# Altium project Metlino.PrjPcb (part 1 of 13)
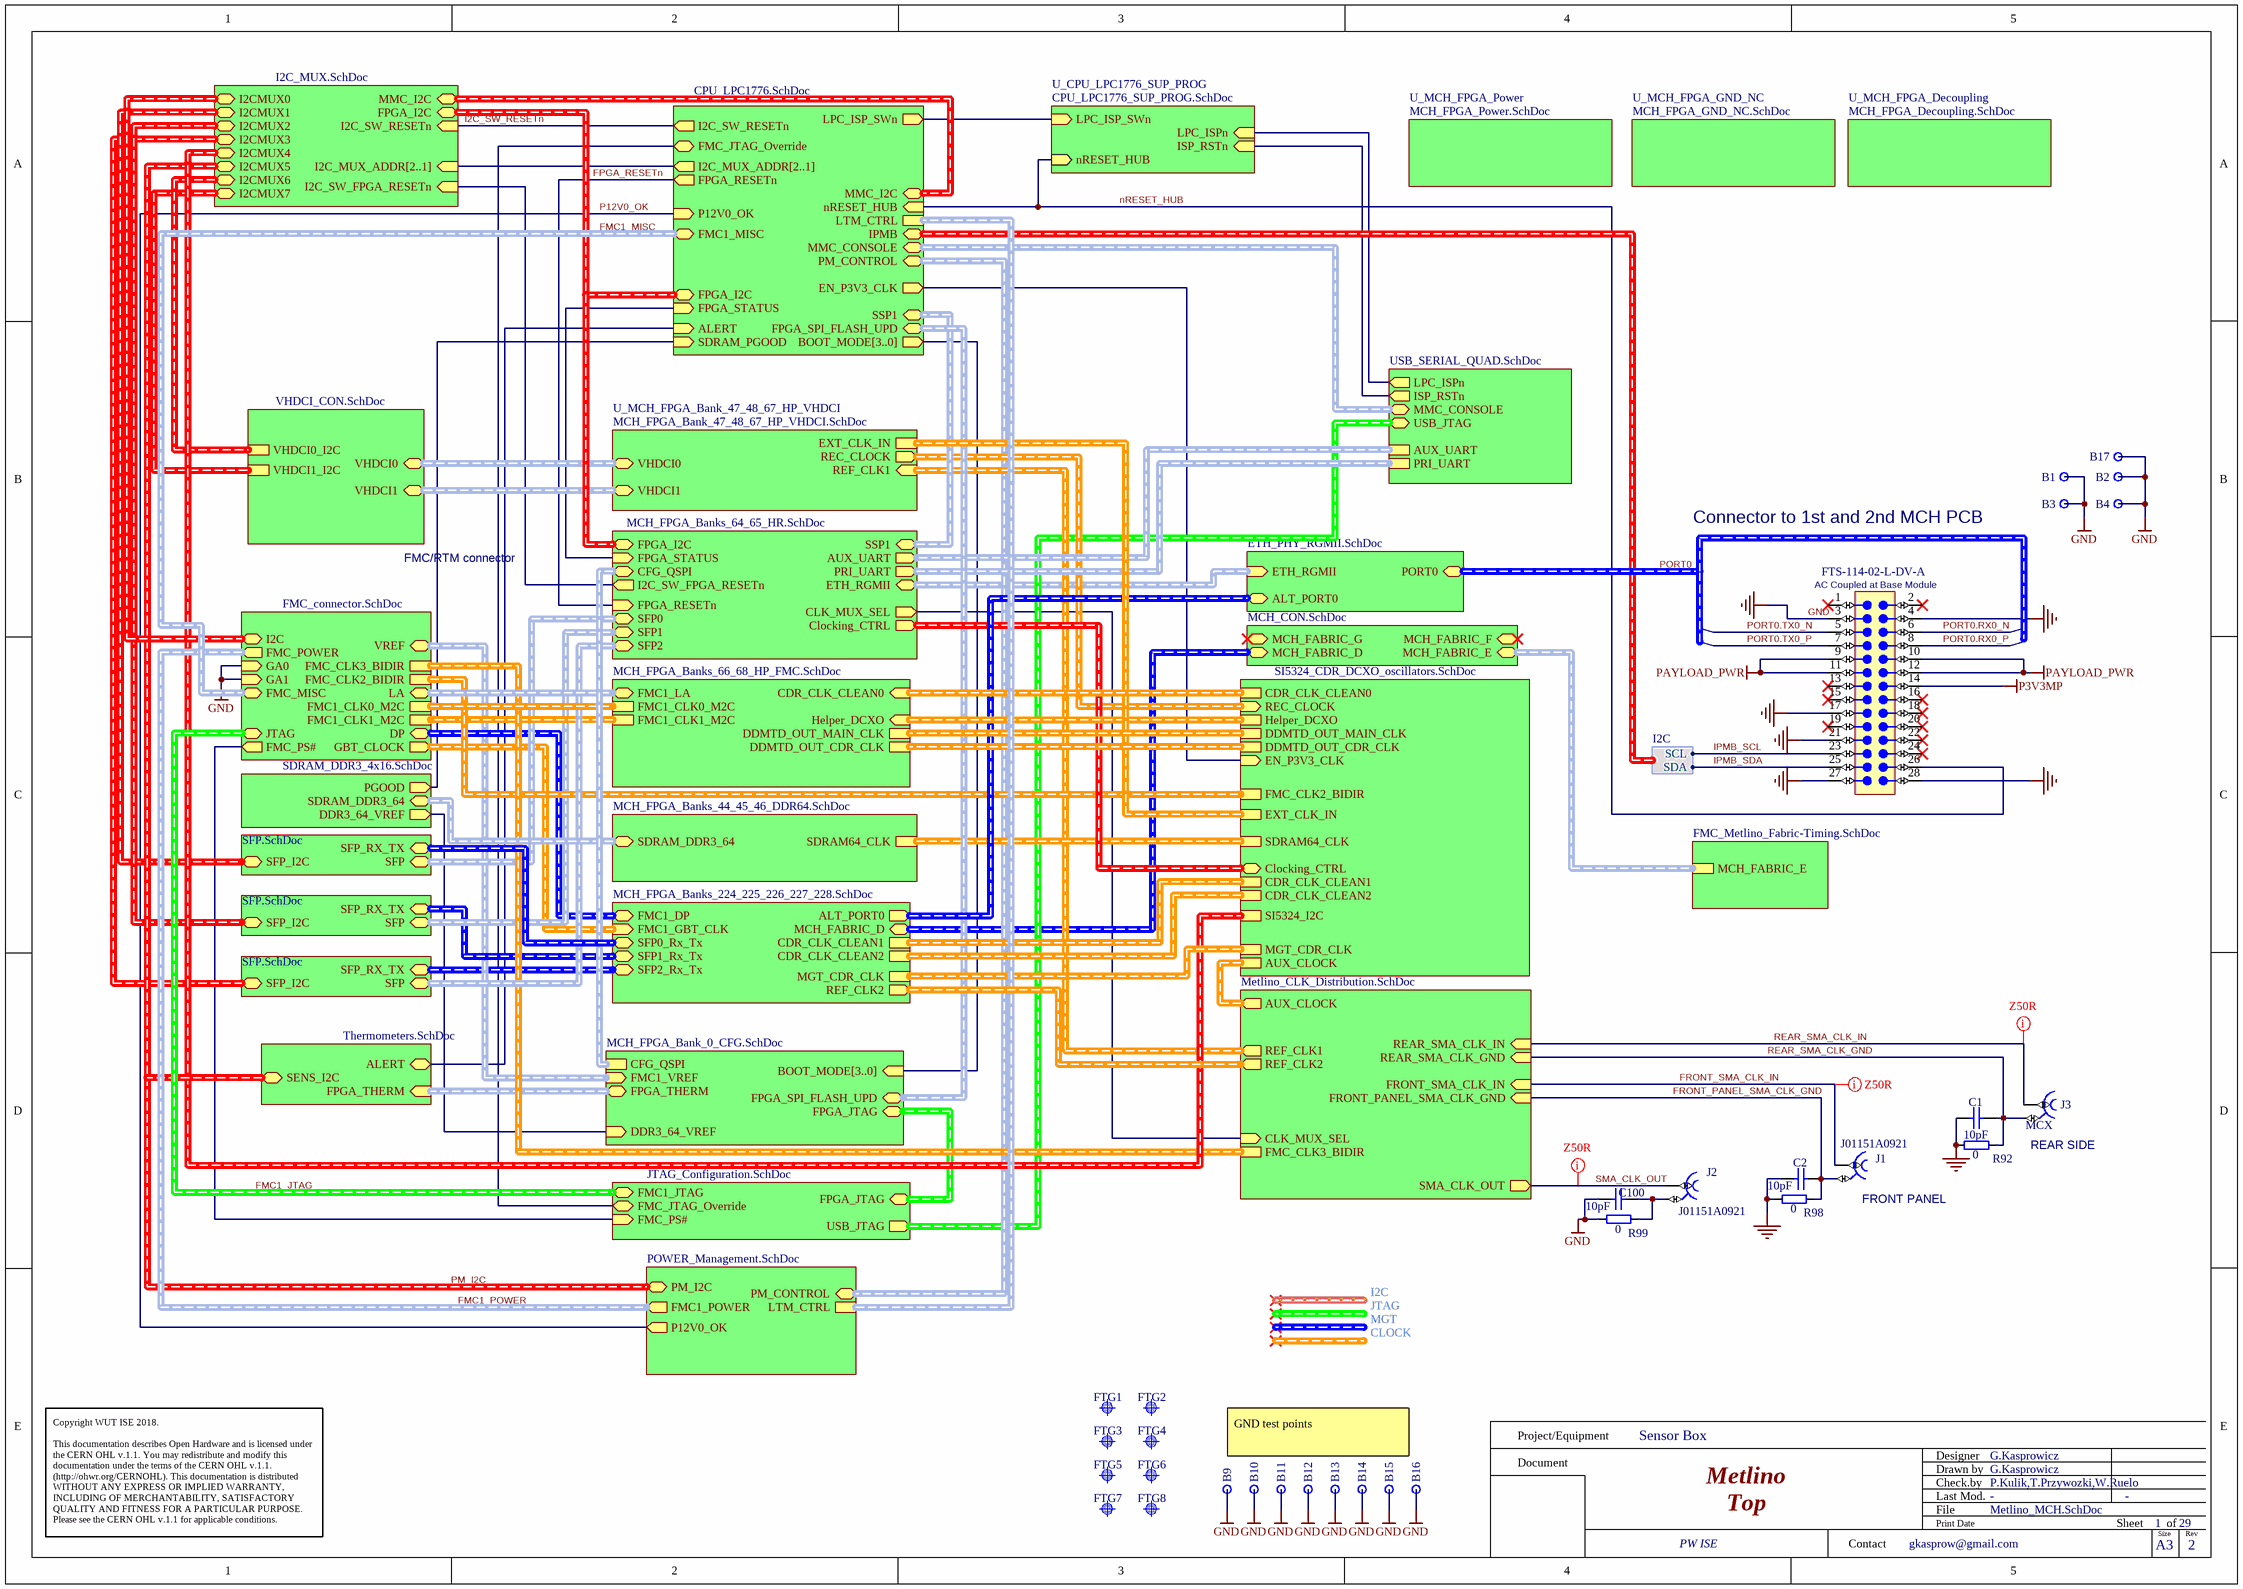
[diagram p0: Metlino_MCH.SchDoc]
30 sheets, 1308 parts. Net scope: hierarchical (ports join the sheet entries above them; power ports are global).
Board file: Metlino.PcbDoc
Sheets:
  Metlino_MCH.SchDoc
    USB_SERIAL_QUAD = USB_SERIAL_QUAD.SchDoc
    SFP1 = SFP.SchDoc
    SFP0 = SFP.SchDoc
    SI5324_CLK_RECOVERY = SI5324_CDR_DCXO_oscillators.SchDoc
      U_DDMTD = DDMTD.SchDoc
    FMC_connector = FMC_connector.SchDoc
    SDRAM_DDR3_4x16 = SDRAM_DDR3_4x16.SchDoc
    JTAG_Configuration = JTAG_Configuration.SchDoc
    POWER_Management = POWER_Management.SchDoc
      PWR_0V9_20A = PWR_0V9_20A.SchDoc
      PWR_DC_DC_EXAR = PWR_DC_DC_EXAR.SchDoc
        U_QUAD_BUCK = Metlino_QUAD_BUCK.SchDoc
    MCH_CON = MCH_CON.SchDoc
    Metlino_CLK_Distribution = Metlino_CLK_Distribution.SchDoc
    Thermometers = Thermometers.SchDoc
    VHDCI_CON = VHDCI_CON.SchDoc
    ETH_PHY_RGMII = ETH_PHY_RGMII.SchDoc
    I2C_MUX = I2C_MUX.SchDoc
    SFP2 = SFP.SchDoc
    U_CPU_LPC1776 = CPU_LPC1776.SchDoc
    U_CPU_LPC1776_SUP_PROG = CPU_LPC1776_SUP_PROG.SchDoc
    U_MCH_FPGA_Banks_44_45_46_DDR64 = MCH_FPGA_Banks_44_45_46_DDR64.SchDoc
    U_MCH_FPGA_Banks_64_65_HR = MCH_FPGA_Banks_64_65_HR.SchDoc
    U_MCH_FPGA_Banks_224_225_226_227_228 = MCH_FPGA_Banks_224_225_226_227_228.SchDoc
    U_MCH_FPGA_Bank_47_48_67_HP_VHDCI = MCH_FPGA_Bank_47_48_67_HP_VHDCI.SchDoc
    U_MCH_FPGA_Bank_0_CFG = MCH_FPGA_Bank_0_CFG.SchDoc
    U_MCH_FPGA_Banks_66_68_HP_FMC = MCH_FPGA_Banks_66_68_HP_FMC.SchDoc
    U_MCH_FPGA_Power = MCH_FPGA_Power.SchDoc
    U_MCH_FPGA_GND_NC = MCH_FPGA_GND_NC.SchDoc
    U_MCH_FPGA_Decoupling = MCH_FPGA_Decoupling.SchDoc
    FMC_Metlino_Fabric-Timing = FMC_Metlino_Fabric-Timing.SchDoc

## Sheet Metlino_MCH.SchDoc: Metlino
size 420 x 297 mm; CheckedBy: P.Kulik,T.Przywozki,W.Ruclo; Author: G.Kasprowicz; CompanyName: WUT ISE; DrawnBy: G.Kasprowicz; Organization: WUT ISE; Address1: PW ISE; Address2: Nowowiejska 15/19 00-665 Warsaw; Address3: gkasprow@gmail.com; DocumentNumber: 1; Revision: 2; SheetNumber: 1; SheetTotal: 29; ModifiedBy: -; CheckedDate: -; Title2: Top; DivGrp: WUT ISE; Designer: G.Kasprowicz; ModifiedDate: -; ProjectName: Sensor Box

### Parts
B1  Plated Hole  [MTG320_550]  (value not drawn)  (no BOM)
B2  Plated Hole  [MTG320_550]  (value not drawn)  (no BOM)
B3  Plated Hole  [MTG320_550]  (value not drawn)  (no BOM)
B4  Plated Hole  [MTG320_550]  (value not drawn)  (no BOM)
B9  Plated Hole  [c130h80]  (value not drawn)  (no BOM)
B10  Plated Hole  [c130h80]  (value not drawn)  (no BOM)
B11  Plated Hole  [c130h80]  (value not drawn)  (no BOM)
B12  Plated Hole  [c130h80]  (value not drawn)  (no BOM)
B13  Plated Hole  [c130h80]  (value not drawn)  (no BOM)
B14  Plated Hole  [c130h80]  (value not drawn)  (no BOM)
B15  Plated Hole  [c130h80]  (value not drawn)  (no BOM)
B16  Plated Hole  [c130h80]  (value not drawn)  (no BOM)
B17  Plated Hole  [MTG320_550]  (value not drawn)  (no BOM)
C1  10pF  [CAPC1608X87N]
C2  10pF  [CAPC1608X87N]
C100  10pF  [CAPC1608X87N]
FTG1  Use only in PCB  [FIDUCIAL_TOP_C100-200]  (value not drawn)
FTG2  Use only in PCB  [FIDUCIAL_TOP_S100-200]  (value not drawn)
FTG3  Use only in PCB  [FIDUCIAL_TOP_C100-200]  (value not drawn)
FTG4  Use only in PCB  [FIDUCIAL_TOP_S100-200]  (value not drawn)
FTG5  Use only in PCB  [FIDUCIAL_TOP_C100-200]  (value not drawn)
FTG6  Use only in PCB  [FIDUCIAL_TOP_S100-200]  (value not drawn)
FTG7  Use only in PCB  [FIDUCIAL_TOP_C100-200]  (value not drawn)
FTG8  Use only in PCB  [FIDUCIAL_TOP_S100-200]  (value not drawn)
J1  Manufacturer Part Number: J01151A0921  [TELEGARTNER_J01151A0921]  (hidden comment: SMA)
J2  Manufacturer Part Number: J01151A0921  [TELEGARTNER_J01151A0921]  (hidden comment: SMA)
J3  MCX  [AMPHENOL_ARF2521-ND]
J4  Manufacturer Part Number: FTS-114-02-L-DV-A  [SAMTEC_FTS-114-02-L-DV-A]  (hidden comment: Header 28)
R92  0  [RESC1608X55N]
R98  0  [RESC1608X55N]
R99  0  [RESC1608X55N]

### Sub-sheets
ETH_PHY_RGMII = ETH_PHY_RGMII.SchDoc: ETH_RGMII (in, harness ETH_RGMII), PORT0 (bidir, harness MGTx1), ALT_PORT0 (bidir, harness MGTx1)  | CmpIndex: 10; Name: ETH_PHY; SymIndex: 1511
FMC_connector = FMC_connector.SchDoc: GBT_CLOCK (out, harness FMC_GBT_CLK), VREF (bidir, harness FMC_VREF), JTAG (bidir, harness JTAG), FMC_MISC (bidir, harness FMC_MICS), I2C (bidir, harness I2C), LA (bidir, harness FMC_LA), DP (bidir, harness FMC_DP), FMC_POWER (out, harness FMC_POWER), FMC1_CLK1_M2C (harness DIFF_CLK), FMC1_CLK0_M2C (harness DIFF_CLK), GA0 (in), GA1 (in), FMC_CLK3_BIDIR (harness DIFF_CLK), FMC_CLK2_BIDIR (harness DIFF_CLK), FMC_PS# (out)  | $$NotCommonProperty_SHEETNAME: HPC1; CmpIndex: 113; Name: FMC_HPC; SHEETNAME: SHEETNAME; SymIndex: 792
FMC_Metlino_Fabric-Timing = FMC_Metlino_Fabric-Timing.SchDoc: MCH_FABRIC_E
I2C_MUX = I2C_MUX.SchDoc: FPGA_I2C (bidir, harness I2C), MMC_I2C (bidir, harness I2C), I2CMUX7 (bidir, harness I2C), I2CMUX6 (bidir, harness I2C), I2CMUX5 (bidir, harness I2C), I2CMUX3 (bidir, harness I2C), I2CMUX2 (bidir, harness I2C), I2CMUX1 (bidir, harness I2C), I2CMUX0 (bidir, harness I2C), I2C_SW_RESETn (in), I2CMUX4 (bidir, harness I2C), I2C_MUX_ADDR[2..1] (in), I2C_SW_FPGA_RESETn (in)  | CmpIndex: 4; Name: I2C_MUX10055; SymIndex: 1875
JTAG_Configuration = JTAG_Configuration.SchDoc: FMC1_JTAG (bidir, harness JTAG), FPGA_JTAG (bidir, harness FPGA_JTAG), USB_JTAG (out, harness USB_JTAG), FMC_PS# (in), FMC_JTAG_Override (bidir)  | $$NotCommonProperty_SHEETNAME: JTAG_CONF; CmpIndex: 107; Name: JTAG_CONF; SHEETNAME: SHEETNAME; SymIndex: 798
MCH_CON = MCH_CON.SchDoc: MCH_FABRIC_E (bidir, harness MCH_FABRIC_E), MCH_FABRIC_D (bidir, harness MCH_FABRIC_D), MCH_FABRIC_F (bidir, harness MCH_FABRIC_F), MCH_FABRIC_G (bidir, harness MCH_FABRIC_G)  | CmpIndex: 102; Name: MCH_CON; SymIndex: 1698
Metlino_CLK_Distribution = Metlino_CLK_Distribution.SchDoc: FRONT_SMA_CLK_IN (in), SMA_CLK_OUT (out), CLK_MUX_SEL (in), REAR_SMA_CLK_IN (in), REAR_SMA_CLK_GND (in), FRONT_PANEL_SMA_CLK_GND (in), REF_CLK1 (out, harness DIFF_CLK), AUX_CLOCK (out, harness DIFF_CLK), FMC_CLK3_BIDIR (harness DIFF_CLK), REF_CLK2 (out, harness DIFF_CLK)  | CmpIndex: 87; Name: Metlino_CLK_Distribution; SymIndex: 1758
POWER_Management = POWER_Management.SchDoc: FMC1_POWER (out, harness FMC1_POWER), PM_CONTROL (bidir, harness PM_CONTROL), PM_I2C (bidir, harness I2C), P12V0_OK (out), LTM_CTRL (harness LTM_CTRL)  | $$NotCommonProperty_SHEETNAME: PWR_MGT; CmpIndex: 105; Name: PWR_MGT; SHEETNAME: SHEETNAME; SymIndex: 796
SDRAM_DDR3_4x16 = SDRAM_DDR3_4x16.SchDoc: PGOOD (out), SDRAM_DDR3_64 (bidir, harness SDRAM_DDR3_64), DDR3_64_VREF (out)  | CmpIndex: 111; SymIndex: 276
SFP0 = SFP.SchDoc: SFP (bidir, harness SFP_CTL), SFP_RX_TX (bidir, harness SFP_MGT), SFP_I2C (bidir, harness I2C)  | CmpIndex: 116; SymIndex: 1422
SFP1 = SFP.SchDoc: SFP (bidir, harness SFP_CTL), SFP_RX_TX (bidir, harness SFP_MGT), SFP_I2C (bidir, harness I2C)  | CmpIndex: 119; SymIndex: 1422
SFP2 = SFP.SchDoc: SFP (bidir, harness SFP_CTL), SFP_RX_TX (bidir, harness SFP_MGT), SFP_I2C (bidir, harness I2C)  | CmpIndex: 3; SymIndex: 1422
SI5324_CLK_RECOVERY = SI5324_CDR_DCXO_oscillators.SchDoc: Clocking_CTRL (bidir, harness WR_I2C_CTRL), Helper_DCXO (harness DIFF_CLK), EXT_CLK_IN (harness DIFF_CLK), SDRAM64_CLK (harness DIFF_CLK), SI5324_I2C (harness I2C), CDR_CLK_CLEAN1 (harness DIFF_CLK), REC_CLOCK (in, harness DIFF_CLK), AUX_CLOCK (harness DIFF_CLK), FMC_CLK2_BIDIR (harness DIFF_CLK), CDR_CLK_CLEAN0 (harness DIFF_CLK), DDMTD_OUT_CDR_CLK (harness DIFF_CLK), DDMTD_OUT_MAIN_CLK (harness DIFF_CLK), MGT_CDR_CLK (harness DIFF_CLK), CDR_CLK_CLEAN2 (harness DIFF_CLK), EN_P3V3_CLK (in)  | CmpIndex: 115; Name: Si5324 Clock recovery9459912232034; SymIndex: 1416
Thermometers = Thermometers.SchDoc: ALERT (bidir), FPGA_THERM (in, harness FPGA_THERM), SENS_I2C (bidir, harness I2C)  | $$NotCommonProperty_SHEETNAME: THERMO; CmpIndex: 47; Name: THERMAL_SENSORS; SymIndex: 789
U_CPU_LPC1776 = CPU_LPC1776.SchDoc: FMC1_MISC (bidir, harness FMC_MICS), I2C_MUX_ADDR[2..1] (out), BOOT_MODE[3..0] (out), FMC_JTAG_Override (bidir), FPGA_SPI_FLASH_UPD (bidir, harness FLASH_UPD), FPGA_RESETn (out), nRESET_HUB (in), MMC_CONSOLE (bidir, harness UART), SDRAM_PGOOD (in), FPGA_I2C (bidir, harness I2C), MMC_I2C (bidir, harness I2C), IPMB (bidir, harness I2C), PM_CONTROL (bidir, harness PM_CONTROL), I2C_SW_RESETn (out), P12V0_OK (in), ALERT (in), LPC_ISP_SWn (out), SSP1 (bidir, harness SPI), FPGA_STATUS (in), LTM_CTRL (harness LTM_CTRL), EN_P3V3_CLK (out)
U_CPU_LPC1776_SUP_PROG = CPU_LPC1776_SUP_PROG.SchDoc: LPC_ISP_SWn (in), ISP_RSTn (in), LPC_ISPn (in), nRESET_HUB (in)
U_MCH_FPGA_Bank_0_CFG = MCH_FPGA_Bank_0_CFG.SchDoc: BOOT_MODE[3..0] (in), FMC1_VREF (in, harness FMC_VREF), FPGA_THERM (bidir, harness FPGA_THERM), FPGA_JTAG (bidir, harness FPGA_JTAG), FPGA_SPI_FLASH_UPD (bidir, harness FPGA_SPI_FLASH_UPD), DDR3_64_VREF (in), CFG_QSPI (harness CFG_QSPI)
U_MCH_FPGA_Bank_47_48_67_HP_VHDCI = MCH_FPGA_Bank_47_48_67_HP_VHDCI.SchDoc: REF_CLK1 (in, harness DIFF_CLK), VHDCI1 (bidir, harness VHDCI1), VHDCI0 (bidir, harness VHDCI0), REC_CLOCK (out, harness DIFF_CLK), EXT_CLK_IN (harness DIFF_CLK)
U_MCH_FPGA_Banks_44_45_46_DDR64 = MCH_FPGA_Banks_44_45_46_DDR64.SchDoc: SDRAM_DDR3_64 (bidir, harness SDRAM_DDR3_64), SDRAM64_CLK (harness DIFF_CLK)
U_MCH_FPGA_Banks_64_65_HR = MCH_FPGA_Banks_64_65_HR.SchDoc: Clocking_CTRL (out, harness WR_I2C_CTRL), SFP1 (bidir, harness SFP_CTL), CLK_MUX_SEL (out), AUX_UART (out, harness UART), PRI_UART (out, harness UART), SFP0 (bidir, harness SFP_CTL), FPGA_RESETn (in), FPGA_I2C (bidir, harness I2C), SFP2 (bidir, harness SFP_CTL), ETH_RGMII (bidir, harness ETH_RGMII), FPGA_STATUS (in), CFG_QSPI (bidir, harness CFG_QSPI), SSP1 (bidir, harness SPI), I2C_SW_FPGA_RESETn (out)
U_MCH_FPGA_Banks_66_68_HP_FMC = MCH_FPGA_Banks_66_68_HP_FMC.SchDoc: Helper_DCXO (in, harness DIFF_CLK), CDR_CLK_CLEAN0 (in, harness DIFF_CLK), FMC1_LA (bidir, harness FMC_LA), FMC1_CLK0_M2C (harness DIFF_CLK), FMC1_CLK1_M2C (harness DIFF_CLK), DDMTD_OUT_CDR_CLK (harness DIFF_CLK), DDMTD_OUT_MAIN_CLK (harness DIFF_CLK)
U_MCH_FPGA_Banks_224_225_226_227_228 = MCH_FPGA_Banks_224_225_226_227_228.SchDoc: ALT_PORT0 (out, harness MGTx1), SFP0_Rx_Tx (bidir, harness SFP_MGT), SFP1_Rx_Tx (bidir, harness SFP_MGT), MCH_FABRIC_D (bidir, harness MCH_FABRIC_D), FMC1_DP (bidir, harness FMC_DP), FMC1_GBT_CLK (in, harness FMC1_GBT_CLK), SFP2_Rx_Tx (bidir, harness SFP_MGT), CDR_CLK_CLEAN2 (harness DIFF_CLK), MGT_CDR_CLK (harness DIFF_CLK), CDR_CLK_CLEAN1 (harness DIFF_CLK), REF_CLK2 (out, harness DIFF_CLK)
U_MCH_FPGA_Decoupling = MCH_FPGA_Decoupling.SchDoc: no entries
U_MCH_FPGA_GND_NC = MCH_FPGA_GND_NC.SchDoc: no entries
U_MCH_FPGA_Power = MCH_FPGA_Power.SchDoc: no entries
USB_SERIAL_QUAD = USB_SERIAL_QUAD.SchDoc: MMC_CONSOLE (bidir, harness UART), USB_JTAG (bidir, harness USB_JTAG), LPC_ISPn (out), ISP_RSTn (out), AUX_UART (harness UART), PRI_UART (harness UART)  | CmpIndex: 121; Name: USB_UART_QUAD; SymIndex: 807
VHDCI_CON = VHDCI_CON.SchDoc: VHDCI1 (bidir, harness VHDCI1), VHDCI0 (bidir, harness VHDCI0), VHDCI1_I2C (harness I2C), VHDCI0_I2C (harness I2C)  | CmpIndex: 11; Name: VHDCI_CON; SymIndex: 1699

### Harnesses
I2C: SCL, SDA

### Nets
GND: B1.1 B2.1 B3.1 B4.1 B9.1 B10.1 B11.1 B12.1 B13.1 B14.1 B15.1 B16.1 B17.1 C1.2 C2.2 C100.2 J4.3 J4.4 J4.17 J4.21 J4.27 J4.28 R92.1 R98.1 R99.1 ; sheet FMC_connector/GA0, sheet FMC_connector/GA1
P3V3MP: J4.14
PAYLOAD_PWR: J4.9 J4.10 J4.11 J4.12
CLK_MUX_SEL: sheet Metlino_CLK_Distribution/CLK_MUX_SEL, sheet U_MCH_FPGA_Banks_64_65_HR/CLK_MUX_SEL
DDR3_64_VREF: sheet SDRAM_DDR3_4x16/DDR3_64_VREF, sheet U_MCH_FPGA_Bank_0_CFG/DDR3_64_VREF
FMC1_MISC.FMC_PS#: sheet FMC_connector/FMC_PS#, sheet JTAG_Configuration/FMC_PS#
FPGA_RESETn: sheet U_CPU_LPC1776/FPGA_RESETn, sheet U_MCH_FPGA_Banks_64_65_HR/FPGA_RESETn
FPGA_STATUS: sheet U_CPU_LPC1776/FPGA_STATUS, sheet U_MCH_FPGA_Banks_64_65_HR/FPGA_STATUS
FRONT_PANEL_SMA_CLK_GND: C2.1 J1.2 R98.2 ; sheet Metlino_CLK_Distribution/FRONT_PANEL_SMA_CLK_GND
FRONT_SMA_CLK_IN: J1.1 ; sheet Metlino_CLK_Distribution/FRONT_SMA_CLK_IN
I2C_SW_FPGA_RESETn: sheet I2C_MUX/I2C_SW_FPGA_RESETn, sheet U_MCH_FPGA_Banks_64_65_HR/I2C_SW_FPGA_RESETn
I2C_SW_RESETn: sheet I2C_MUX/I2C_SW_RESETn, sheet U_CPU_LPC1776/I2C_SW_RESETn
IPMB_SCL: J4.23 ; sheet U_CPU_LPC1776/IPMB.SCL
IPMB_SDA: J4.25 ; sheet U_CPU_LPC1776/IPMB.SDA
ISP_RSTn: sheet USB_SERIAL_QUAD/ISP_RSTn, sheet U_CPU_LPC1776_SUP_PROG/ISP_RSTn
LPC_ISP_SWn: sheet U_CPU_LPC1776/LPC_ISP_SWn, sheet U_CPU_LPC1776_SUP_PROG/LPC_ISP_SWn
LPC_ISPn: sheet USB_SERIAL_QUAD/LPC_ISPn, sheet U_CPU_LPC1776_SUP_PROG/LPC_ISPn
nRESET_HUB: J4.26 ; sheet U_CPU_LPC1776/nRESET_HUB, sheet U_CPU_LPC1776_SUP_PROG/nRESET_HUB  [project net MRnR]
P12V0_OK: sheet POWER_Management/P12V0_OK, sheet U_CPU_LPC1776/P12V0_OK
PGOOD: sheet SDRAM_DDR3_4x16/PGOOD, sheet U_CPU_LPC1776/SDRAM_PGOOD
PORT0.RX0_N: J4.6
PORT0.RX0_P: J4.8
PORT0.TX0_N: J4.5
PORT0.TX0_P: J4.7
REAR_SMA_CLK_GND: C1.1 J3.2 R92.2 ; sheet Metlino_CLK_Distribution/REAR_SMA_CLK_GND
REAR_SMA_CLK_IN: J3.1 ; sheet Metlino_CLK_Distribution/REAR_SMA_CLK_IN
SMA_CLK_OUT: J2.1 ; sheet Metlino_CLK_Distribution/SMA_CLK_OUT
NetC100_1: C100.1 J2.2 R99.2
NetIC13_4: sheet JTAG_Configuration/FMC_JTAG_Override, sheet U_CPU_LPC1776/FMC_JTAG_Override
NetIC17_1: sheet SI5324_CLK_RECOVERY/EN_P3V3_CLK, sheet U_CPU_LPC1776/EN_P3V3_CLK
NetIC34_3: sheet Thermometers/ALERT, sheet U_CPU_LPC1776/ALERT

Not connected (* = marked no-connect by the designer): J4 1* 2* 13* 15* 16* 18* 19* 20* 22* 24*

### Buses and harness runs
bus sheet I2C_MUX/I2C_MUX_ADDR[2..1] = sheet U_CPU_LPC1776/I2C_MUX_ADDR[2..1]
bus sheet U_CPU_LPC1776/BOOT_MODE[3..0] = sheet U_MCH_FPGA_Bank_0_CFG/BOOT_MODE[3..0]
harness FMC1_JTAG = sheet FMC_connector/JTAG = sheet JTAG_Configuration/FMC1_JTAG
harness FMC1_MISC = sheet FMC_connector/FMC_MISC = sheet U_CPU_LPC1776/FMC1_MISC
harness FMC1_POWER = sheet FMC_connector/FMC_POWER = sheet POWER_Management/FMC1_POWER
harness PM_I2C = sheet I2C_MUX/I2CMUX5 = sheet POWER_Management/PM_I2C = sheet Thermometers/SENS_I2C
harness PORT0 = sheet ETH_PHY_RGMII/PORT0
harness sheet ETH_PHY_RGMII/ALT_PORT0 = sheet U_MCH_FPGA_Banks_224_225_226_227_228/ALT_PORT0
harness sheet ETH_PHY_RGMII/ETH_RGMII = sheet U_MCH_FPGA_Banks_64_65_HR/ETH_RGMII
harness sheet FMC_connector/DP = sheet U_MCH_FPGA_Banks_224_225_226_227_228/FMC1_DP
harness sheet FMC_connector/FMC1_CLK0_M2C = sheet U_MCH_FPGA_Banks_66_68_HP_FMC/FMC1_CLK0_M2C
harness sheet FMC_connector/FMC1_CLK1_M2C = sheet U_MCH_FPGA_Banks_66_68_HP_FMC/FMC1_CLK1_M2C
harness sheet FMC_connector/FMC_CLK2_BIDIR = sheet SI5324_CLK_RECOVERY/FMC_CLK2_BIDIR
harness sheet FMC_connector/FMC_CLK3_BIDIR = sheet Metlino_CLK_Distribution/FMC_CLK3_BIDIR
harness sheet FMC_connector/GBT_CLOCK = sheet U_MCH_FPGA_Banks_224_225_226_227_228/FMC1_GBT_CLK
harness sheet FMC_connector/I2C = sheet I2C_MUX/I2CMUX0
harness sheet FMC_connector/LA = sheet U_MCH_FPGA_Banks_66_68_HP_FMC/FMC1_LA
harness sheet FMC_connector/VREF = sheet U_MCH_FPGA_Bank_0_CFG/FMC1_VREF
harness sheet FMC_Metlino_Fabric-Timing/MCH_FABRIC_E = sheet MCH_CON/MCH_FABRIC_E
harness sheet I2C_MUX/FPGA_I2C = sheet U_CPU_LPC1776/FPGA_I2C = sheet U_MCH_FPGA_Banks_64_65_HR/FPGA_I2C
harness sheet I2C_MUX/I2CMUX1 = sheet SFP0/SFP_I2C
harness sheet I2C_MUX/I2CMUX2 = sheet SFP1/SFP_I2C
harness sheet I2C_MUX/I2CMUX3 = sheet SFP2/SFP_I2C
harness sheet I2C_MUX/I2CMUX4 = sheet SI5324_CLK_RECOVERY/SI5324_I2C
harness sheet I2C_MUX/I2CMUX6 = sheet VHDCI_CON/VHDCI0_I2C
harness sheet I2C_MUX/I2CMUX7 = sheet VHDCI_CON/VHDCI1_I2C
harness sheet I2C_MUX/MMC_I2C = sheet U_CPU_LPC1776/MMC_I2C
harness sheet JTAG_Configuration/FPGA_JTAG = sheet U_MCH_FPGA_Bank_0_CFG/FPGA_JTAG
harness sheet JTAG_Configuration/USB_JTAG = sheet USB_SERIAL_QUAD/USB_JTAG
harness sheet MCH_CON/MCH_FABRIC_D = sheet U_MCH_FPGA_Banks_224_225_226_227_228/MCH_FABRIC_D
harness sheet Metlino_CLK_Distribution/AUX_CLOCK = sheet SI5324_CLK_RECOVERY/AUX_CLOCK
harness sheet Metlino_CLK_Distribution/REF_CLK1 = sheet U_MCH_FPGA_Bank_47_48_67_HP_VHDCI/REF_CLK1
harness sheet Metlino_CLK_Distribution/REF_CLK2 = sheet U_MCH_FPGA_Banks_224_225_226_227_228/REF_CLK2
harness sheet POWER_Management/LTM_CTRL = sheet U_CPU_LPC1776/LTM_CTRL
harness sheet POWER_Management/PM_CONTROL = sheet U_CPU_LPC1776/PM_CONTROL
harness sheet SDRAM_DDR3_4x16/SDRAM_DDR3_64 = sheet U_MCH_FPGA_Banks_44_45_46_DDR64/SDRAM_DDR3_64
harness sheet SFP0/SFP = sheet U_MCH_FPGA_Banks_64_65_HR/SFP0
harness sheet SFP0/SFP_RX_TX = sheet U_MCH_FPGA_Banks_224_225_226_227_228/SFP0_Rx_Tx
harness sheet SFP1/SFP = sheet U_MCH_FPGA_Banks_64_65_HR/SFP1
harness sheet SFP1/SFP_RX_TX = sheet U_MCH_FPGA_Banks_224_225_226_227_228/SFP1_Rx_Tx
harness sheet SFP2/SFP = sheet U_MCH_FPGA_Banks_64_65_HR/SFP2
harness sheet SFP2/SFP_RX_TX = sheet U_MCH_FPGA_Banks_224_225_226_227_228/SFP2_Rx_Tx
harness sheet SI5324_CLK_RECOVERY/CDR_CLK_CLEAN0 = sheet U_MCH_FPGA_Banks_66_68_HP_FMC/CDR_CLK_CLEAN0
harness sheet SI5324_CLK_RECOVERY/CDR_CLK_CLEAN1 = sheet U_MCH_FPGA_Banks_224_225_226_227_228/CDR_CLK_CLEAN1
harness sheet SI5324_CLK_RECOVERY/CDR_CLK_CLEAN2 = sheet U_MCH_FPGA_Banks_224_225_226_227_228/CDR_CLK_CLEAN2
harness sheet SI5324_CLK_RECOVERY/Clocking_CTRL = sheet U_MCH_FPGA_Banks_64_65_HR/Clocking_CTRL
harness sheet SI5324_CLK_RECOVERY/DDMTD_OUT_CDR_CLK = sheet U_MCH_FPGA_Banks_66_68_HP_FMC/DDMTD_OUT_CDR_CLK
harness sheet SI5324_CLK_RECOVERY/DDMTD_OUT_MAIN_CLK = sheet U_MCH_FPGA_Banks_66_68_HP_FMC/DDMTD_OUT_MAIN_CLK
harness sheet SI5324_CLK_RECOVERY/EXT_CLK_IN = sheet U_MCH_FPGA_Bank_47_48_67_HP_VHDCI/EXT_CLK_IN
harness sheet SI5324_CLK_RECOVERY/Helper_DCXO = sheet U_MCH_FPGA_Banks_66_68_HP_FMC/Helper_DCXO
harness sheet SI5324_CLK_RECOVERY/MGT_CDR_CLK = sheet U_MCH_FPGA_Banks_224_225_226_227_228/MGT_CDR_CLK
harness sheet SI5324_CLK_RECOVERY/REC_CLOCK = sheet U_MCH_FPGA_Bank_47_48_67_HP_VHDCI/REC_CLOCK
harness sheet SI5324_CLK_RECOVERY/SDRAM64_CLK = sheet U_MCH_FPGA_Banks_44_45_46_DDR64/SDRAM64_CLK
harness sheet Thermometers/FPGA_THERM = sheet U_MCH_FPGA_Bank_0_CFG/FPGA_THERM
harness sheet U_CPU_LPC1776/FPGA_SPI_FLASH_UPD = sheet U_MCH_FPGA_Bank_0_CFG/FPGA_SPI_FLASH_UPD
harness sheet U_CPU_LPC1776/MMC_CONSOLE = sheet USB_SERIAL_QUAD/MMC_CONSOLE
harness sheet U_CPU_LPC1776/SSP1 = sheet U_MCH_FPGA_Banks_64_65_HR/SSP1
harness sheet U_MCH_FPGA_Bank_0_CFG/CFG_QSPI = sheet U_MCH_FPGA_Banks_64_65_HR/CFG_QSPI
harness sheet U_MCH_FPGA_Bank_47_48_67_HP_VHDCI/VHDCI0 = sheet VHDCI_CON/VHDCI0
harness sheet U_MCH_FPGA_Bank_47_48_67_HP_VHDCI/VHDCI1 = sheet VHDCI_CON/VHDCI1
harness sheet U_MCH_FPGA_Banks_64_65_HR/AUX_UART = sheet USB_SERIAL_QUAD/AUX_UART
harness sheet U_MCH_FPGA_Banks_64_65_HR/PRI_UART = sheet USB_SERIAL_QUAD/PRI_UART

### Layout directives
net class Z50R: FRONT_SMA_CLK_IN, REAR_SMA_CLK_IN, SMA_CLK_OUT

### Notes on the sheet
- Connector to 1st and 2nd MCH PCB
- FMC/RTM connector
- (near J4) AC Coupled at Base Module
- (near J1) FRONT PANEL
- (near J3) REAR SIDE
- I2C
- JTAG
- MGT
- CLOCK
- GND test points
- Project/Equipment
- Document
- Designer
- Drawn by
- Check.by
- Copyright WUT ISE 2018.
  This documentation describes Open Hardware and is licensed under the CERN OHL v.1.1. You may redistribute and modify this documentation under the terms of the CERN OHL v.1.1. (http://ohwr.org/CERNOHL). This documentation is distributed WITHOUT ANY EXPRESS OR IMPLIED WARRANTY, INCLUDING OF MERCHANTABILITY, SATISFACTORY QUALITY AND FITNESS FOR A PARTICULAR PURPOSE. Please see the CERN OHL v.1.1 for applicable conditions.
- Contact
- File
- Last Mod.
- Print Date
- Sheet
- Size
- A3
- of
- Rev

### Library data of the parts
B1-B4 B17 = PLATED_HOLE3.2_PAD5.5: Single Terminal Socket; Part Description: Plated Through Hole: Hole Dia.=3.2mm Pad Dia.=5.5mm; Mounted: No; Part Number: PLATED_HOLE3.2_PAD5.5; Component Type: Standard (No BOM); Pin Count: 1; Family: Plated Hole; Socket: No; SMD: No; Sense: No; Status: None; ComponentHeight: 0mm; HelpURL: Undefined; Author: CERN DEM JMW; CreateDate: 01.10.2012; LatestRevisionDate: 01.10.2012; PackageDescription: Plated Through Hole: Hole Dia.=3.2mm Pad Dia.=5.5mm
B9-B16 = PLATED_HOLE0.8_PAD1.3: Single Terminal Socket; Part Description: Plated Through Hole: Hole Dia.=0.8mm Pad Dia.=1.3mm, IPC-7251 Level C; Mounted: No; Part Number: PLATED_HOLE0.8_PAD1.3; Component Type: Standard (No BOM); Pin Count: 1; Family: Plated Hole; Socket: No; SMD: No; Sense: No; Status: None; ComponentHeight: 0mm; HelpURL: Undefined; Author: CERN DEM JLC; CreateDate: 30.10.2008; LatestRevisionDate: 30.10.2008; PackageDescription: Plated Through Hole: Hole Dia.=0.8mm Pad Dia.=1.3mm, IPC-7251 Level C
C1 C2 C100 = CC0603_10PF_50V_5%_NP0: Non-polarised capacitor; Manufacturer: GENERIC; Part Description: SMD Multilayer Chip Ceramic Capacitor; Manufacturer1 Part Number: 223886715109; Tolerance: ±5%; Voltage: 50V; TC: C0G/NP0; Manufacturer Part Number: CC0603_10PF_50V_5%_NP0; Part Number: CC0603_10PF_50V_5%_NP0; Value: 10pF; Component Kind: Standard; Component Type: Standard; Pin Count: 2; Status: Preferred; Case: 0603; Mounted: Yes; Socket: No; SMD: Yes; Sense: No; Manufacturer1 Example: PHYCOMP; Manufacturer1 ComponentHeight: 0.87mm; HelpURL: \\cern.ch\dfs\Applications\Altium\Datasheets\CC0603_NP0_PHYCOMP.pdf; Author: CERN DEM JLC; CreateDate: 03.12.2007; LatestRevisionDate: 03.12.2007
FTG1 FTG3 FTG5 FTG7 = FIDUCIAL_TARGET_C100-200: Fiducial Target; Part Description: Round Fiducial Target, Top Layer, 1.0mm, Top Solder 2.0mm, Keepout =2.0mm; Mounted: No; Part Number: FIDUCIAL_TARGET_C100-200; Component Kind: Standard (No BOM); Component Type: Standard (No BOM); Pin Count: 1; Family: Fiducial; Socket: No; SMD: Yes; Sense: No; Status: None; ComponentHeight: 0mm; HelpURL: Undefined; Author: CERN DEM JLC; CreateDate: 09.02.2010; LatestRevisionDate: 04.04.2012; PackageDescription: Round Fiducial Target, Top Layer, 1.0mm, Top Solder 2.0mm, Keepout =2.0mm
FTG2 FTG4 FTG6 FTG8 = FIDUCIAL_TARGET_S100-200: Fiducial Target; Part Description: Square Fiducial Target, Top Layer, 1.0mm, Top Solder 2.0mm, Keepout =2.0mm; Mounted: No; Part Number: FIDUCIAL_TARGET_S100-200; Component Kind: Standard (No BOM); Component Type: Standard (No BOM); Pin Count: 1; Family: Fiducial; Socket: No; SMD: Yes; Sense: No; Status: None; ComponentHeight: 0mm; HelpURL: Undefined; Author: CERN DEM JLC; CreateDate: 09.02.2010; LatestRevisionDate: 04.04.2012; PackageDescription: Square Fiducial Target, Top Layer, 1.0mm, Top Solder 2.0mm, Keepout =2.0mm
J1 J2 = Telegartner_J01151A0921: Part Description: 50 Ohm SMA Right Angle PCB Jack; PressFit: No; Manufacturer: TELEGARTNER; Part Number: TELEGARTNER_J01151A0921; Component Kind: Standard; Component Type: Standard; Pin Count: 2; Family: SMA; Mounted: Yes; Socket: No; SMD: No; Sense: No; Status: None; ComponentHeight: 10.65mm; HelpURL: \\cern.ch\dfs\Applications\Altium\Datasheets\TELEGARTNER_J01151A0921.pdf; Author: CERN DEM JLC; CreateDate: 06.12.2016; LatestRevisionDate: 06.12.2016
J3 = CON_MCX: Part Description: 50 Ohms MCX Right Angle PCB Receptacle (Jack); Manufacturer: AMPHENOL; PressFit: No; Part Number: AMPHENOL_ARF2521-ND; Component Kind: Standard; Component Type: Standard; Pin Count: 2; Family: MCX; Mounted: Yes; Socket: No; SMD: No; Sense: No; Status: None; Manufacturer Part Number: AMPHENOL_ARF2521-ND; ComponentHeight: 6; HelpURL: \\cern.ch\dfs\Applications\Altium\Datasheets\AMPHENOL_34-1030-12G.pdf; Author: GK; CreateDate: 21.02.2017; LatestRevisionDate: 21.02.2017
J4 = SAMTEC_FTS-114-02-L-DV-A: Connector 28 Male; Manufacturer: SAMTEC; Part Description: 28 Contacts, Pitch 1.27mm - Dual Row Surface Mount Straight Strip Header; PressFit: No; Part Number: SAMTEC_FTS-114-02-L-DV-A; Component Kind: Standard; Component Type: Standard; Pin Count: 28; Family: Header 28; Mounted: Yes; Socket: No; Sense: No; SMD: Yes; Status: None; ComponentHeight: 3.18mm; HelpURL: \\cern.ch\dfs\Applications\Altium\Datasheets\SAMTEC_FTS-114-02-L-DV-A.pdf; Author: CERN DEM MR; CreateDate: 07.03.2016; LatestRevisionDate: 07.03.2016
R92 R98 R99 = R0603_0R_JUMPER: Resistor; Manufacturer: GENERIC; Part Description: 1A (0.05R Max DC Resistance) Zero Ohm Jumper; Manufacturer1 Part Number: NRC06Z0; PressFit: No; Manufacturer Part Number: R0603_0R_JUMPER; Part Number: R0603_0R_JUMPER; Value: 0; Component Kind: Standard; Component Type: Standard; Pin Count: 2; Status: Preferred; Case: 0603; Mounted: Yes; Sense: No; Socket: No; SMD: Yes; Manufacturer1 Example: NIC COMPONENT; Manufacturer1 ComponentHeight: 0.55mm; HelpURL: \\cern.ch\dfs\Applications\Altium\Datasheets\R0603_NIC_NRC.pdf; Author: CERN DEM JLC; CreateDate: 03.12.2007; LatestRevisionDate: 13.03.2008

## Sheet USB_SERIAL_QUAD.SchDoc: Metlino
size 420 x 297 mm; CheckedBy: P.Kulik,T.Przywozki,W.Ruclo; Author: G.Kasprowicz; CompanyName: WUT ISE; DrawnBy: G.Kasprowicz; Organization: WUT ISE; Address1: PW ISE; Address2: Nowowiejska 15/19 00-665 Warsaw; Address3: gkasprow@gmail.com; DocumentNumber: 25; Revision: 2; SheetNumber: 25; SheetTotal: 29; ModifiedBy: -; CheckedDate: -; Title2: USB JTAG & UARTs; DivGrp: WUT ISE; Designer: G.Kasprowicz; ModifiedDate: -; ProjectName: Sensor Box
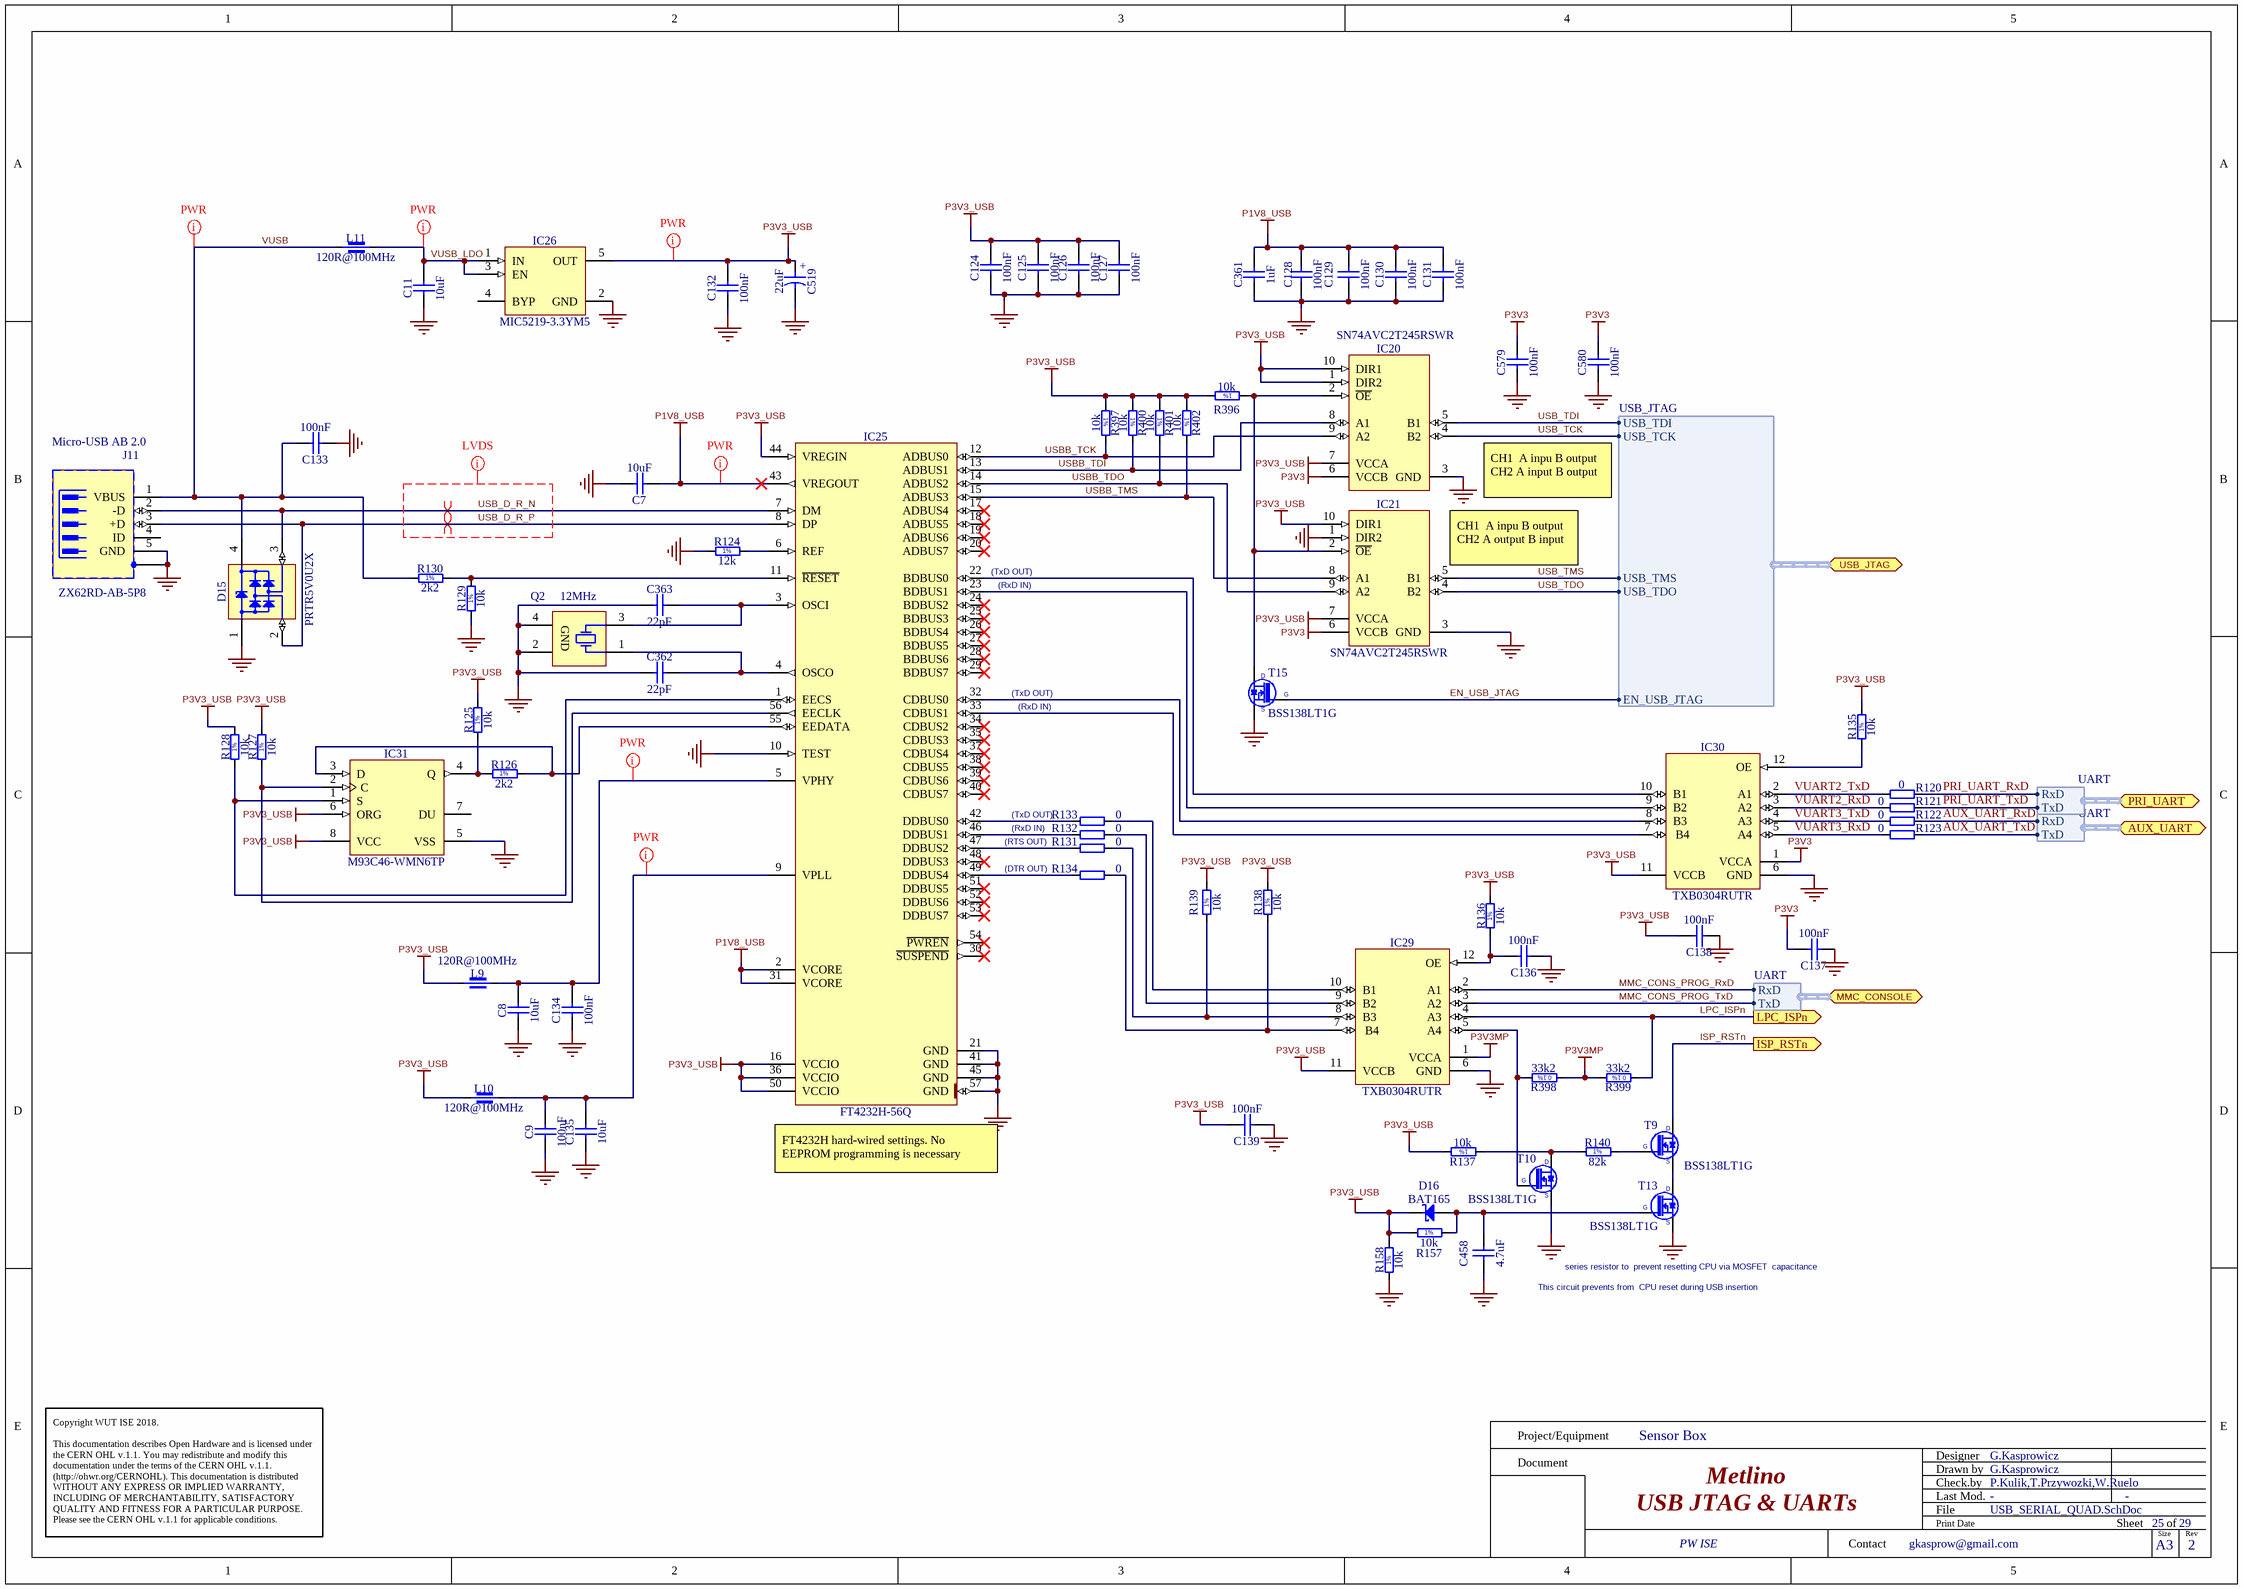
[diagram p1: USB_SERIAL_QUAD.SchDoc]

### Parts
C7  10uF  [CAPC1608X87N]
C8  10uF  [CAPC1608X87N]
C9  100nF  [CAPC0603X33N]
C11  10uF  [CAPC1608X87N]
C124  100nF  [CAPC0603X33N]
C125  100nF  [CAPC0603X33N]
C126  100nF  [CAPC0603X33N]
C127  100nF  [CAPC0603X33N]
C128  100nF  [CAPC0603X33N]
C129  100nF  [CAPC0603X33N]
C130  100nF  [CAPC0603X33N]
C131  100nF  [CAPC0603X33N]
C132  100nF  [CAPC0603X33N]
C133  100nF  [CAPC0603X33N]
C134  100nF  [CAPC0603X33N]
C135  10uF  [CAPC1608X87N]
C136  100nF  [CAPC0603X33N]
C137  100nF  [CAPC0603X33N]
C138  100nF  [CAPC0603X33N]
C139  100nF  [CAPC0603X33N]
C361  1uF  [CAPC1005X55N]
C362  22pF  [CAPC1005X55N]
C363  22pF  [CAPC1005X55N]
C458  4.7uF  [CAPC1709X95N]
C519  22uF  [CAPMP3216X180N]
C579  100nF  [CAPC0603X33N]
C580  100nF  [CAPC0603X33N]
D15  PRTR5V0U2X  [SOT190P230X110-4N]
D16  BAT165  [SOD2512X110N]
IC20  SN74AVC2T245RSWR  [QFN40P140X180X55-10N]
IC21  SN74AVC2T245RSWR  [QFN40P140X180X55-10N]
IC25  FT4232H-56Q  [QFN50P800X800X100-57N-S620]
IC26  MIC5219-3.3YM5  [SOT95P280X145-5N]
IC29  TXB0304RUTR  [TEXAS_RUT (R-PUQFN-N12)]
IC30  TXB0304RUTR  [TEXAS_RUT (R-PUQFN-N12)]
IC31  M93C46-WMN6TP  [SOIC127P600X175-8N]
J11  Micro-USB AB 2.0  Manufacturer Part Number: ZX62RD-AB-5P8  [HIROSE_ZX62RD-AB-5P8]
L9  120R@100MHz  [INDC1608X65N]
L10  120R@100MHz  [INDC1608X65N]
L11  120R@100MHz  [INDC1608X65N]
Q2  12MHz  [XTAL_TXC_7M]
R120  0  [RESC1005X40N]
R121  0  [RESC1005X40N]
R122  0  [RESC1005X40N]
R123  0  [RESC1005X40N]
R124  12k  [RESC1005X40N]
R125  10k  [RESC1005X40N]
R126  2k2  [RESC1005X40N]
R127  10k  [RESC1005X40N]
R128  10k  [RESC1005X40N]
R129  10k  [RESC1005X40N]
R130  2k2  [RESC1005X40N]
R131  0  [RESC1005X40N]
R132  0  [RESC1005X40N]
R133  0  [RESC1005X40N]
R134  0  [RESC1005X40N]
R135  10k  [RESC1005X40N]
R136  10k  [RESC1005X40N]
R137  10k  [RESC1005X40N]
R138  10k  [RESC1005X40N]
R139  10k  [RESC1005X40N]
R140  82k  [RESC1005X40N]
R157  10k  [RESC1005X40N]
R158  10k  [RESC1005X40N]
R396  10k  [RESC1005X40N]
R397  10k  [RESC1005X40N]
R398  33k2  [RESC1608X55N]
R399  33k2  [RESC1608X55N]
R400  10k  [RESC1005X40N]
R401  10k  [RESC1005X40N]
R402  10k  [RESC1005X40N]
T9  BSS138LT1G  [SOT95P240X110-3N]
T10  BSS138LT1G  [SOT95P240X110-3N]
T13  BSS138LT1G  [SOT95P240X110-3N]
T15  BSS138LT1G  [SOT95P240X110-3N]

### Ports
AUX_UART (bidir, harness UART), ISP_RSTn (out), LPC_ISPn (out), MMC_CONSOLE (bidir, harness UART), PRI_UART (bidir, harness UART), USB_JTAG (bidir, harness USB_JTAG)

### Harnesses
UART: RxD, TxD
USB_JTAG: USB_TDI, USB_TCK, USB_TMS, USB_TDO, EN_USB_JTAG

### Nets
GND: C7.2 C8.1 C9.1 C11.1 C124.1 C125.1 C126.1 C127.1 C128.1 C129.1 C130.1 C131.1 C132.1 C133.1 C134.1 C135.1 C136.1 C137.1 C138.1 C139.1 C361.2 C362.1 C363.1 C458.1 C519.2 C579.1 C580.1 D15.1(GND) IC20.3(GND) IC21.1(DIR2) IC21.3(GND) IC25.10(TEST) IC25.21(GND) IC25.41(GND) IC25.45(GND) IC25.57(GND) IC26.2(GND) IC29.6(GND) IC30.6(GND) IC31.5(VSS) J11.5(GND) J11.6(SH) Q2.2(GND) Q2.4(GND) R124.1 R129.1 R158.1 T10.2(S) T13.2(S) T15.2(S)
P1V8_USB: C7.1 C128.2 C129.2 C130.2 C131.2 C361.1 IC25.2(VCORE) IC25.31(VCORE) IC25.43(VREGOUT)
P3V3: C137.2 C579.2 C580.2 IC20.6(VCCB) IC21.6(VCCB) IC30.1(VCCA)
P3V3_USB: C124.2 C125.2 C126.2 C127.2 C132.2 C138.2 C139.2 C519.1 D16.1(C) IC20.1(DIR2) IC20.7(VCCA) IC20.10(DIR1) IC21.7(VCCA) IC21.10(DIR1) IC25.16(VCCIO) IC25.36(VCCIO) IC25.44(VREGIN) IC25.50(VCCIO) IC26.5(OUT) IC29.11(VCCB) IC30.11(VCCB) IC31.6(ORG) IC31.8(VCC) L9.1 L10.1 R125.2 R127.2 R128.2 R135.2 R136.2 R137.2 R138.2 R139.2 R157.1 R158.2 R396.2 R397.1 R400.1 R401.1 R402.1
P3V3MP: IC29.1(VCCA) R398.1 R399.2
AUX_UART_RxD: R122.1 ; port AUX_UART.RxD
AUX_UART_TxD: R123.1 ; port AUX_UART.TxD
EN_USB_JTAG: T15.1(G) ; port USB_JTAG.EN_USB_JTAG
ISP_RSTn: T9.3(D) ; port ISP_RSTn
LPC_ISPn: IC29.4(A3) R399.1 ; port LPC_ISPn
MMC_CONS_PROG_RxD: IC29.2(A1) ; port MMC_CONSOLE.RxD
MMC_CONS_PROG_TxD: IC29.3(A2) ; port MMC_CONSOLE.TxD
PRI_UART_RxD: R120.1 ; port PRI_UART.RxD
PRI_UART_TxD: R121.1 ; port PRI_UART.TxD
USB_D_R_N: D15.3(I/O2) IC25.7(DM) J11.2(-D)
USB_D_R_P: D15.2(I/O1) IC25.8(DP) J11.3(+D)
USB_TCK: IC20.4(B2) ; port USB_JTAG.USB_TCK  [project net USB_JTAG.USB_TCK]
USB_TDI: IC20.5(B1) ; port USB_JTAG.USB_TDI  [project net USB_JTAG.USB_TDI]
USB_TDO: IC21.4(B2) ; port USB_JTAG.USB_TDO  [project net USB_JTAG.USB_TDO]
USB_TMS: IC21.5(B1) ; port USB_JTAG.USB_TMS  [project net USB_JTAG.USB_TMS]
USBB_TCK: IC20.9(A2) IC25.12(ADBUS0) R397.2
USBB_TDI: IC20.8(A1) IC25.13(ADBUS1) R400.2
USBB_TDO: IC21.9(A2) IC25.14(ADBUS2) R401.2
USBB_TMS: IC21.8(A1) IC25.15(ADBUS3) R402.2
VUART2_RxD: IC30.3(A2) R121.2
VUART2_TxD: IC30.2(A1) R120.2
VUART3_RxD: IC30.5(A4) R123.2
VUART3_TxD: IC30.4(A3) R122.2
VUSB: C133.2 D15.4(VCC) J11.1(VBUS) L11.1 R130.1
VUSB_LDO: C11.2 IC26.1(IN) IC26.3(EN) L11.2
NetC8_2: C8.2 C134.2 IC25.5(VPHY) L9.2
NetC9_2: C9.2 C135.2 IC25.9(VPLL) L10.2
NetC136_2: C136.2 IC29.12(OE) R136.1
NetC362_2: C362.2 IC25.4(OSCO) Q2.1(X)
NetC363_2: C363.2 IC25.3(OSCI) Q2.3(X)
NetC458_2: C458.2 D16.2(A) R157.2 T13.1(G)
NetIC20_2: IC20.2(~{OE}) IC21.2(~{OE}) R396.1 T15.3(D)
NetIC25_1: IC25.1(EECS) IC31.1(S) R128.1
NetIC25_6: IC25.6(REF) R124.2
NetIC25_11: IC25.11(~{RESET}) R129.2 R130.2
NetIC25_22: IC25.22(BDBUS0) IC30.10(B1)
NetIC25_23: IC25.23(BDBUS1) IC30.9(B2)
NetIC25_32: IC25.32(CDBUS0) IC30.8(B3)
NetIC25_33: IC25.33(CDBUS1) IC30.7(B4)
NetIC25_42: IC25.42(DDBUS0) R133.1
NetIC25_46: IC25.46(DDBUS1) R132.1
NetIC25_47: IC25.47(DDBUS2) R131.1
NetIC25_49: IC25.49(DDBUS4) R134.1
NetIC25_55: IC25.55(EEDATA) IC31.3(D) R126.2
NetIC25_56: IC25.56(EECLK) IC31.2(C) R127.1
NetIC29_5: IC29.5(A4) R398.2 T10.1(G)
NetIC29_7: IC29.7(B4) R134.2 R138.1
NetIC29_8: IC29.8(B3) R131.2 R139.1
NetIC29_9: IC29.9(B2) R132.2
NetIC29_10: IC29.10(B1) R133.2
NetIC30_12: IC30.12(OE) R135.1
NetIC31_4: IC31.4(Q) R125.1 R126.1
NetR137_1: R137.1 R140.1 T10.3(D)
NetR140_2: R140.2 T9.1(G)
NetT9_2: T9.2(S) T13.3(D)

Not connected (* = marked no-connect by the designer): IC25 17(ADBUS4)* 18(ADBUS5)* 19(ADBUS6)* 20(ADBUS7)* 24(BDBUS2)* 25(BDBUS3)* 26(BDBUS4)* 27(BDBUS5)* 28(BDBUS6)* 29(BDBUS7)* 30(~{SUSPEND})* 34(CDBUS2)* 35(CDBUS3)* 37(CDBUS4)* 38(CDBUS5)* 39(CDBUS6)* 40(CDBUS7)* 48(DDBUS3)* 51(DDBUS5)* 52(DDBUS6)* 53(DDBUS7)* 54(~{PWREN})*; IC26 4(BYP); IC31 7(DU); J11 4(ID)

### Layout directives
differential pair: USB_D_R_N, USB_D_R_P
net class PWR: NetC8_2, NetC9_2, P1V8_USB, P3V3_USB, VUSB, VUSB_LDO
net class LVDS: USB_D_R_N, USB_D_R_P

### Notes on the sheet
- CH1  A inpu B output
  CH2 A input B output
- (near IC25) (TxD OUT)
- (near IC25) (RxD IN)
- (near IC21) CH1  A inpu B output
  CH2 A output B input
- (TxD OUT)
- (RxD IN)
- (RTS OUT)
- (DTR OUT)
- (near IC25) FT4232H hard-wired settings. No EEPROM programming is necessary
- (near T13) series resistor to  prevent resetting CPU via MOSFET  capacitance
- This circuit prevents from  CPU reset during USB insertion
- Project/Equipment
- Document
- Designer
- Drawn by
- Check.by
- Copyright WUT ISE 2018.
  This documentation describes Open Hardware and is licensed under the CERN OHL v.1.1. You may redistribute and modify this documentation under the terms of the CERN OHL v.1.1. (http://ohwr.org/CERNOHL). This documentation is distributed WITHOUT ANY EXPRESS OR IMPLIED WARRANTY, INCLUDING OF MERCHANTABILITY, SATISFACTORY QUALITY AND FITNESS FOR A PARTICULAR PURPOSE. Please see the CERN OHL v.1.1 for applicable conditions.
- Contact
- File
- Last Mod.
- Print Date
- Sheet
- Size
- A3
- of
- Rev
- (in symbol CTE3216-18_22UF_6.3V_10%_LESR0900) +
- (in symbol R0402_2K2_1%_0.0625W_100PPM) 1%
- (in symbol R0402_10K_1%_0.0625W_100PPM) 1%
- (in symbol R0402_12K_1%_0.0625W_100PPM) 1%
- (in symbol R0402_82K_1%_0.0625W_100PPM) 1%
- (in symbol R0603_33K2_0.1%_0.063W_10PPM) 0.1%

### Library data of the parts
C7 C8 C11 C135 = CC0603_10UF_6.3V_20%_X5R: Non-polarised capacitor; Manufacturer: GENERIC; Part Description: SMD Multilayer Chip Ceramic Capacitor; Manufacturer1 Part Number: C0603C106M9PAC; Tolerance: ±20%; Voltage: 6.3V; TC: X5R; Manufacturer Part Number: CC0603_10uF_6.3V_20%_X5R; Part Number: CC0603_10UF_6.3V_20%_X5R; Value: 10uF; Component Kind: Standard; Component Type: Standard; Pin Count: 2; Status: Preferred; Case: 0603; Mounted: Yes; Socket: No; SMD: Yes; Sense: No; Manufacturer1 Example: KEMET; Manufacturer1 ComponentHeight: 0.95mm; HelpURL: \\cern.ch\dfs\Applications\Altium\Datasheets\CC0603_X5R_KEMET.pdf; Author: CERN DEM JLC; CreateDate: 03.12.2007; LatestRevisionDate: 03.12.2007
C9 C124-C134 C136-C139 C579 C580 = CC0201_100NF_6.3V_10%_X5R: Non-polarised capacitor; Manufacturer: GENERIC; Part Description: SMD Multilayer Chip Ceramic Capacitor; Manufacturer1 Part Number: 02016D104KAT2A; Tolerance: ±10%; Voltage: 6.3V; TC: X5R; Manufacturer Part Number: CC0201_100NF_6.3V_10%_X5R; Part Number: CC0201_100NF_6.3V_10%_X5R; Value: 100nF; Component Kind: Standard; Component Type: Standard; Pin Count: 2; Status: Not Recommended; Case: 0201; Mounted: Yes; Socket: No; SMD: Yes; Sense: No; Manufacturer1 Example: AVX; Manufacturer1 ComponentHeight: 0.33mm; HelpURL: \\cern.ch\dfs\Applications\Altium\Datasheets\CC0201_X5R_AVX.pdf; Author: CERN DEM JLC; CreateDate: 03.12.2007; LatestRevisionDate: 03.12.2007
C361 = CC0402_1UF_16V_10%_X5R: Non-polarised capacitor; Manufacturer: GENERIC; Part Description: SMD Multilayer Chip Ceramic Capacitor; Manufacturer1 Part Number: C1005X5R1C105KT; Tolerance: ±10%; Voltage: 16V; TC: X5R; Manufacturer Part Number: CC0402_1UF_16V_10%_X5R; Part Number: CC0402_1UF_16V_10%_X5R; Value: 1uF; Component Kind: Standard; Component Type: Standard; Pin Count: 2; Status: Preferred; Case: 0402; Mounted: Yes; Socket: No; SMD: Yes; Sense: No; Manufacturer1 Example: TDK; Manufacturer1 ComponentHeight: 0.55mm; HelpURL: \\cern.ch\dfs\Applications\Altium\Datasheets\CC0402_X5R_TDK_C.pdf; Author: CERN DEM JLC; CreateDate: 25.10.2012; LatestRevisionDate: 25.10.2012
C362 C363 = CC0402_22PF_50V_5%_C0G: Non-polarised capacitor; Manufacturer: GENERIC; Part Description: SMD Multilayer Chip Ceramic Capacitor; Manufacturer1 Part Number: C0402C220J5GACTU; Tolerance: ±5%; Voltage: 50V; TC: C0G/NP0; Manufacturer Part Number: CC0402_22PF_50V_5%_C0G; Part Number: CC0402_22PF_50V_5%_C0G; Value: 22pF; Component Kind: Standard; Component Type: Standard; Pin Count: 2; Status: Preferred; Case: 0402; Mounted: Yes; Socket: No; SMD: Yes; Sense: No; Manufacturer1 Example: KEMET; Manufacturer1 ComponentHeight: 0.55mm; HelpURL: \\cern.ch\dfs\Applications\Altium\Datasheets\CC0805_C0G_KEMET_(Commercial Grade).pdf; Author: CERN DEM JLC; CreateDate: 03.12.2007; LatestRevisionDate: 03.12.2007
C458 = CC0603_4.7UF_16V_10%_X5R: Non-polarised capacitor; Manufacturer: GENERIC; Part Description: SMD Multilayer Chip Ceramic Capacitor; Manufacturer1 Part Number: EMK107ABJ475KA-T; Tolerance: ±10%; Voltage: 16V; TC: X5R; Manufacturer Part Number: CC0603_4.7UF_16V_10%_X5R; Part Number: CC0603_4.7UF_16V_10%_X5R; Value: 4.7uF; Component Kind: Standard; Component Type: Standard; Pin Count: 2; Status: None; Case: 0603; Mounted: Yes; Socket: No; SMD: Yes; Sense: No; Manufacturer1 Example: TAIYO YUDEN; Manufacturer1 ComponentHeight: 0.95mm; HelpURL: \\cern.ch\dfs\Applications\Altium\Datasheets\CC0603_X7R_TAIYO-YUDEN_HIGH-VALUE.pdf; Author: CERN DEM JLC; CreateDate: 16.12.2013; LatestRevisionDate: 16.09.2014
C519 = CTE3216-18_22UF_6.3V_10%_LESR0900: Polarised capacitor; Manufacturer: GENERIC; Part Description: Low ESR 0R9 Solid Tantalum Chip Capacitor; Manufacturer1 Part Number: TPSA226K006R0900; Tolerance: ±10%; Voltage: 6.3V; Manufacturer Part Number: CTE3216-18_22UF_6.3V_10%_LESR0900; Part Number: CTE3216-18_22UF_6.3V_10%_LESR0900; Value: 22uF; Component Kind: Standard; Component Type: Standard; Pin Count: 2; Status: Preferred; Case: A; Mounted: Yes; Socket: No; SMD: Yes; Sense: No; Manufacturer1 Example: AVX; Manufacturer1 ComponentHeight: 1.8mm; HelpURL: \\cern.ch\dfs\Applications\Altium\Datasheets\CTE-LESR_AVX_TPS.pdf; Author: CERN DEM JLC; CreateDate: 05.05.2008; LatestRevisionDate: 20.01.2009
D15 = PRTR5V0U2X: Ultra Low Capacitance Double Rail-to-Rail ESD Protection Diode; Manufacturer: NXP SEMICONDUCTORS; Part Description: Ultra Low Capacitance (1pF) Double Rail-to-Rail ESD Protection Diode (8kV); Voltage: 5.5V; PressFit: No; Bonding: No; Manufacturer Part Number: PRTR5V0U2X; PackageDescription: SOT143B, SOT, 1.90mm Pitch; 4 Pin, 1.30mm W X 2.90mm L X 1.10mm H body, IPC Medium Density; Part Number: PRTR5V0U2X; Component Kind: Standard; Component Type: Standard; Device: PRTR5V0U2X; Pin Count: 4; Case: SOT143B; Mounted: Yes; Socket: No; SMD: Yes; Sense: No; ComponentHeight: 1.1mm; HelpURL: \\cern.ch\dfs\Applications\Altium\Datasheets\PRTR5V0U2X.pdf; Author: CERN DEM JLC; CreateDate: 22.03.2011; LatestRevisionDate: 22.03.2011
D16 = BAT165: Schottky Diode; Manufacturer: INFINEON; Part Description: Medium Power AF Schottky Diode; Voltage: 40V; Power: 750mA; PressFit: No; Bonding: No; Manufacturer Part Number: BAT165; PackageDescription: Small Outline Diode (SOD-323), 1.70mm W X 1.25mm L X 1.10mm H body,  IPC Medium Density; Part Number: BAT165; Component Kind: Standard; Component Type: Standard; Device: BAT165; Pin Count: 2; Case: SOD323; Mounted: Yes; Socket: No; SMD: Yes; Sense: No; ComponentHeight: 1.1mm; HelpURL: \\cern.ch\dfs\Applications\Altium\Datasheets\BAT165.pdf; Author: CERN DEM JLC; CreateDate: 12.11.2014; LatestRevisionDate: 12.11.2014
IC20 IC21 = SN74AVC2T245RSWR: Dual-Bit Dual-Supply Bus Transceiver With Configurable Voltage Translation and 3-State Outputs; Manufacturer: TEXAS INSTRUMENTS; PressFit: No; Bonding: No; Manufacturer Part Number: SN74AVC2T245RSWR; PackageDescription: QFN, 0.40mm Pitch, Rect.;10 Pin, 1.80mm L X 1.40mm W X 0.55mm H Body, IPC Medium Density; Part Description: Dual-Bit Dual-Supply Bus Transceiver With Configurable Voltage Translation and 3-State Outputs; Part Number: SN74AVC2T245RSWR; Component Kind: Standard; Component Type: Standard; Device: SN74AVC2T245RSWR; Status: Not Recommended; Pin Count: 10; Case: QFN10; Mounted: Yes; Socket: No; SMD: Yes; Sense: No; ComponentHeight: 0.55mm; Author: CERN DEM JLC; HelpURL: \\cern.ch\dfs\Applications\Altium\Datasheets\SN74AVC2T245RSWR.pdf; CreateDate: 07.07.2014; LatestRevisionDate: 30.03.2017
IC25 = FT4232H-56Q: Quad High Speed USB to Multipurpose UART/MPSSE IC; Manufacturer: FUTURE TECHNOLOGY DEVICES INTERNATIONAL (FTDI); PressFit: No; Bonding: No; Manufacturer Part Number: FT4232H-56Q; PackageDescription: QFN, 0.50mm Pitch, Square; 56 Pin, 8.00mm L X 8.00mm W X 1.00mm H body (6.1mm X 6.1mm Thermal tab), IPC Medium Density; Part Description: Quad High Speed USB to Multipurpose UART/MPSSE IC; Part Number: FT4232H-56Q; Component Kind: Standard; Component Type: Standard; Device: FT4232H-56Q; Pin Count: 57; Case: QFN56; Mounted: Yes; Socket: No; SMD: Yes; Sense: No; ComponentHeight: 1mm; Author: CERN DEM JLC; HelpURL: \\cern.ch\dfs\Applications\Altium\Datasheets\FT4232H-56Q.pdf; CreateDate: 11.10.2016; LatestRevisionDate: 11.10.2016
IC26 = MIC5219-3.3YM5: 500mA Peak Output LDO Regulator; Part Description: 3.3V 500mA Peak Output Low Drop-Out  (LDO) Regulator; Manufacturer: MICROCHIP TECHNOLOGY; PressFit: No; Bonding: No; Part Number: MIC5219-3.3YM5; Component Kind: Standard; Component Type: Standard; Device: MIC5219-3.3YM5; PackageDescription: SOT, 0.95mm pitch; 5 pin, 1.60mm W X 2.90mm L X 1.45mm H body, IPC Medium Density; Manufacturer Part Number: MIC5219-3.3YM5; Pin Count: 5; Case: SOT23-5; Mounted: Yes; Socket: No; SMD: Yes; Sense: No; ComponentHeight: 1.45mm; HelpURL: \\cern.ch\dfs\Applications\Altium\Datasheets\MIC5219-3.3YM5.pdf; Author: CERN DEM WB; CreateDate: 16.04.2019; LatestRevisionDate: 16.04.2019
IC29 IC30 = TXB0304RUTR: 4-bit Bidirectional Auto-direction Sensing Translator with Fully Symmetric 0.9V to 3.6V Range; Manufacturer: TEXAS INSTRUMENTS; PressFit: No; Bonding: No; Manufacturer Part Number: TXB0304RUTR; PackageDescription: SON, TEXAS RUT (R-PUQFN-N12), 0.50mm Pitch, 12-pin, 1.70mm W  X 2.00mm L X 0.55mm Height; Part Description: 4-bit Bidirectional Auto-direction Sensing Translator with Fully Symmetric 0.9V to 3.6V Range; Part Number: TXB0304RUTR; Component Kind: Standard; Component Type: Standard; Device: TXB0304RUTR; Pin Count: 12; Case: QFN12; Mounted: Yes; Socket: No; SMD: Yes; Sense: No; ComponentHeight: 0.55mm; Author: CERN DEM JLC; HelpURL: \\cern.ch\dfs\Applications\Altium\Datasheets\TXB0304RUTR.pdf; CreateDate: 27.10.2014; LatestRevisionDate: 28.10.2014
IC31 = M93C46-WMN6TP: 2.5 to 5.5 V, 1Kb (128x8) Serial Microwire Bus EEPROM; Manufacturer: ST MICROELECTRONICS; Part Description: 1Kbit (128 x 8 bit or 64 x 16 bit) MICROWIRE® Serial Access EEPROM; PressFit: No; Bonding: No; Manufacturer Part Number: M93C46-WMN6TP; PackageDescription: SOIC 8, Pitch 1.27mm - Body 4x5mm, IPC Medium Density; Part Number: M93C46-WMN6TP; Component Kind: Standard; Component Type: Standard; Device: M93C46-WMN6TP; Pin Count: 8; Case: SOIC8; Mounted: Yes; Socket: No; SMD: Yes; Sense: No; ComponentHeight: 1.75mm; HelpURL: \\cern.ch\dfs\Applications\Altium\Datasheets\M93C46-WMN6TP.pdf; Author: CERN DEM JLC; CreateDate: 15.11.2012; LatestRevisionDate: 15.11.2012
J11 = HIROSE_ZX62RD-AB-5P8: 5 Pin + 1 Shield USB Receptacle; Manufacturer: HIROSE (HRS); Part Description: Micro-USB 2.0 Right Angle, SMD Type AB - Reverse (Top mount), Shell Through Hole; PressFit: No; Part Number: HIROSE_ZX62RD-AB-5P8; Component Kind: Standard; Component Type: Standard; Pin Count: 7; Family: Micro-USB AB 2.0; Mounted: Yes; Socket: No; SMD: Yes; Sense: No; Status: Obsolete; ComponentHeight: 2.35mm; HelpURL: \\cern.ch\dfs\Applications\Altium\Datasheets\HIROSE_ZX62RD-AB-5P8.pdf; ComponentLink1URL: \\cern.ch\dfs\Applications\Altium\Datasheets\HIROSE_ZX62RD-AB-5P8_Package-Drawing.pdf; ComponentLink1Description: Package-Drawing; Author: CERN DEM JLC; CreateDate: 29.10.2014; LatestRevisionDate: 22.06.2017
L9-L11 = IND0603_MURATA_BLM18SG121TN1D: Manufacturer: MURATA; Part Description: SMD EMIFIL Suppression Chip Ferrite Bead; Tolerance: ±25%; Power: 3A; Resistance: 0.025R; Manufacturer Part Number: BLM18SG121TN1D; Part Number: IND0603_MURATA_BLM18SG121TN1D; Value: 120R@100MHz; Component Kind: Standard; Component Type: Standard; Pin Count: 2; Status: None; Case: 0603; Mounted: Yes; Socket: No; SMD: Yes; Sense: No; ComponentHeight: 0.65mm; HelpURL: \\cern.ch\dfs\Applications\Altium\Datasheets\IND0603_MURATA_BLM18S.pdf; Author: CERN DEM JLC; CreateDate: 23.07.2014; LatestRevisionDate: 25.10.2018
Q2 = XTAL_12MHZ_TXC_7M-12.000MAAJ-T: Crystal 4 pins 1=XTAL Control 2=GND3=XTAL 4=GND; Manufacturer: TXC CORPORATION; Part Description: ±30ppm 18pF -20°C to +70°C  4 Pins, 3.2x2.5X0.8mm, SMD Sealing Crystal, 7M Series; PressFit: No; Bonding: No; Manufacturer Part Number: 7M-12.000MAAJ-T; PackageDescription: 4 Pins, 2.5x3.2mm, SMD Sealing Crystal, 7M Serie; Part Number: XTAL_12MHZ_TXC_7M-12.000MAAJ-T; Value: 12MHz; Component Kind: Standard; Component Type: Standard; Pin Count: 4; Mounted: Yes; Socket: No; SMD: Yes; Sense: No; ComponentHeight: 0.8mm; HelpURL: \\cern.ch\dfs\Applications\Altium\Datasheets\XTAL_TXC_7M.pdf; Author: CERN DEM JLC; CreateDate: 19.06.2012; LatestRevisionDate: 19.06.2012
R120-R123 R131-R134 = R0402_0R_JUMPER: Resistor; Manufacturer: GENERIC; Part Description: 1A (0.05R Max DC Resistance) Zero Ohm Jumper; Manufacturer1 Part Number: 232270591001L; PressFit: No; Manufacturer Part Number: R0402_0R_JUMPER; Part Number: R0402_0R_JUMPER; Value: 0; Component Kind: Standard; Component Type: Standard; Pin Count: 2; Status: Not Recommended; Case: 0402; Mounted: Yes; Sense: No; Socket: No; SMD: Yes; Manufacturer1 Example: YAGEO PHYCOMP; Manufacturer1 ComponentHeight: 0.4mm; HelpURL: \\cern.ch\dfs\Applications\Altium\Datasheets\R0402_Phycomp_RC0402.pdf; Author: CERN DEM JLC; CreateDate: 03.12.2007; LatestRevisionDate: 17.10.2012
R124 = R0402_12K_1%_0.0625W_100PPM: Resistor - 1%; Manufacturer: GENERIC; Part Description: General Purpose Thick Film Chip Resistor; Manufacturer1 Part Number: 232270671203L; TC: ±100ppm/°C; PressFit: No; Manufacturer Part Number: R0402_12K_1%_0.0625W_100PPM; Part Number: R0402_12K_1%_0.0625W_100PPM; Tolerance: ±1%; Value: 12k; Component Kind: Standard; Component Type: Standard; Pin Count: 2; Status: Not Recommended; Power: 0.0625W; Case: 0402; Mounted: Yes; Sense: No; Socket: No; SMD: Yes; Manufacturer1 Example: YAGEO PHYCOMP; Manufacturer1 ComponentHeight: 0.4mm; HelpURL: \\cern.ch\dfs\Applications\Altium\Datasheets\R0402_Phycomp_RC0402.pdf; Author: CERN DEM JLC; CreateDate: 03.12.2007; LatestRevisionDate: 17.10.2012
R125 R127-R129 R135-R139 R157 R158 R396 R397 R400-R402 = R0402_10K_1%_0.0625W_100PPM: Resistor - 1%; Manufacturer: GENERIC; Part Description: General Purpose Thick Film Chip Resistor; Manufacturer1 Part Number: 232270671003L; TC: ±100ppm/°C; PressFit: No; Manufacturer Part Number: R0402_10K_1%_0.0625W_100PPM; Part Number: R0402_10K_1%_0.0625W_100PPM; Tolerance: ±1%; Value: 10k; Component Kind: Standard; Component Type: Standard; Pin Count: 2; Status: Not Recommended; Power: 0.0625W; Case: 0402; Mounted: Yes; Sense: No; Socket: No; SMD: Yes; Manufacturer1 Example: YAGEO PHYCOMP; Manufacturer1 ComponentHeight: 0.4mm; HelpURL: \\cern.ch\dfs\Applications\Altium\Datasheets\R0402_Phycomp_RC0402.pdf; Author: CERN DEM JLC; CreateDate: 03.12.2007; LatestRevisionDate: 17.10.2012
R126 R130 = R0402_2K2_1%_0.0625W_100PPM: Resistor - 1%; Manufacturer: GENERIC; Part Description: General Purpose Thick Film Chip Resistor; Manufacturer1 Part Number: 232270672202L; TC: ±100ppm/°C; PressFit: No; Manufacturer Part Number: R0402_2K2_1%_0.0625W_100PPM; Part Number: R0402_2K2_1%_0.0625W_100PPM; Tolerance: ±1%; Value: 2k2; Component Kind: Standard; Component Type: Standard; Pin Count: 2; Status: Not Recommended; Power: 0.0625W; Case: 0402; Mounted: Yes; Sense: No; Socket: No; SMD: Yes; Manufacturer1 Example: YAGEO PHYCOMP; Manufacturer1 ComponentHeight: 0.4mm; HelpURL: \\cern.ch\dfs\Applications\Altium\Datasheets\R0402_Phycomp_RC0402.pdf; Author: CERN DEM JLC; CreateDate: 03.12.2007; LatestRevisionDate: 17.10.2012
R140 = R0402_82K_1%_0.0625W_100PPM: Resistor - 1%; Manufacturer: GENERIC; Part Description: General Purpose Thick Film Chip Resistor; Manufacturer1 Part Number: 232270678203L; TC: ±100ppm/°C; PressFit: No; Manufacturer Part Number: R0402_82K_1%_0.0625W_100PPM; Part Number: R0402_82K_1%_0.0625W_100PPM; Tolerance: ±1%; Value: 82k; Component Kind: Standard; Component Type: Standard; Pin Count: 2; Status: Not Recommended; Power: 0.0625W; Case: 0402; Mounted: Yes; Sense: No; Socket: No; SMD: Yes; Manufacturer1 Example: YAGEO PHYCOMP; Manufacturer1 ComponentHeight: 0.4mm; HelpURL: \\cern.ch\dfs\Applications\Altium\Datasheets\R0402_Phycomp_RC0402.pdf; Author: CERN DEM JLC; CreateDate: 03.12.2007; LatestRevisionDate: 17.10.2012
R398 R399 = R0603_33K2_0.1%_0.063W_10PPM: Resistor - 0.1%; Manufacturer: GENERIC; Part Description: Thin Film Chip Resistor; Manufacturer1 Part Number: RN73C1J33K2BTDF; Power: 0.063W; TC: ±10ppm; PressFit: No; Manufacturer Part Number: R0603_33K2_0.1%_0.063W_10PPM; Part Number: R0603_33K2_0.1%_0.063W_10PPM; Tolerance: ±0.1%; Value: 33k2; Component Kind: Standard; Component Type: Standard; Pin Count: 2; Status: Not Recommended; Case: 0603; Mounted: Yes; Sense: No; Socket: No; SMD: Yes; Manufacturer1 Example: TYCO HOLSWORTHY; Manufacturer1 ComponentHeight: 0.5mm; HelpURL: \\cern.ch\dfs\Applications\Altium\Datasheets\R0603_Tyco_RN73.pdf; Author: CERN DEM JLC; CreateDate: 03.12.2007; LatestRevisionDate: 13.03.2008
T9 T10 T13 T15 = BSS138LT1G: N-CHANNEL MOSFET WITH DIODE; Manufacturer: ON SEMICONDUCTOR; Part Description: 50V 200mA N-Channel Enhancement Mode Field-Effect Transistor; PressFit: No; Bonding: No; Manufacturer Part Number: BSS138LT1G; PackageDescription: SOT23 3-Leads, Pitch 0.95mm - Body 1.4x3mm, IPC Medium Density; Part Number: BSS138LT1G; Component Kind: Standard; Component Type: Standard; Device: BSS138LT1G; Pin Count: 3; Case: SOT23-3; Mounted: Yes; Socket: No; SMD: Yes; Sense: No; ComponentHeight: 1.11mm; HelpURL: \\cern.ch\dfs\Applications\Altium\Datasheets\BSS138LT1G.pdf; Author: CERN DEM JLC; CreateDate: 23.03.2009; LatestRevisionDate: 23.03.2009